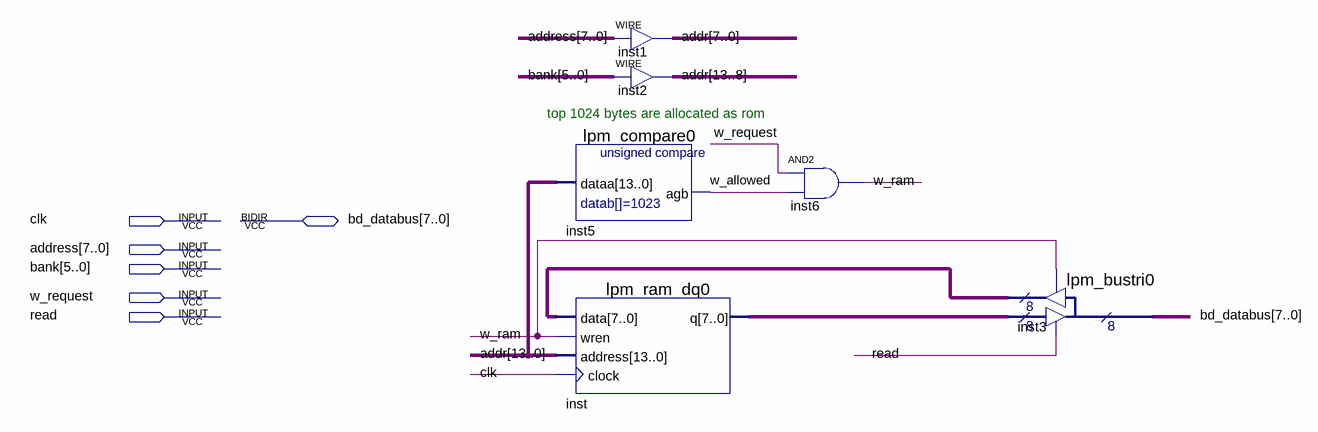
[diagram p0: schematic sheet]
// Quartus schematic WN_memory.bdf as structural Verilog: 6 symbols, 6 pins
module WN_memory (
  input  clk,
  input  [7:0] address,
  input  [5:0] bank,
  input  w_request,
  input  read,
  inout  [7:0] bd_databus
);

  wire w_allowed, w_ram;
  wire [7:0] inst3_result, inst_q;
  wire [13:0] addr;

  lpm_compare0 inst5 (.dataa(addr), .agb(w_allowed));
  lpm_ram_dq0 inst (.data(inst3_result), .wren(w_ram), .address(addr), .clock(clk), .q(inst_q));
  assign addr[7:0] = address;  // WIRE inst1
  assign addr[13:8] = bank;  // WIRE inst2
  and inst6 (w_ram, w_request, w_allowed);
  lpm_bustri0 inst3 (.enabledt(read), .data(inst_q), .enabletr(w_ram), .result(inst3_result), .tridata(bd_databus));

  // Notes on the sheet:
  //   top 1024 bytes are allocated as rom
endmodule
